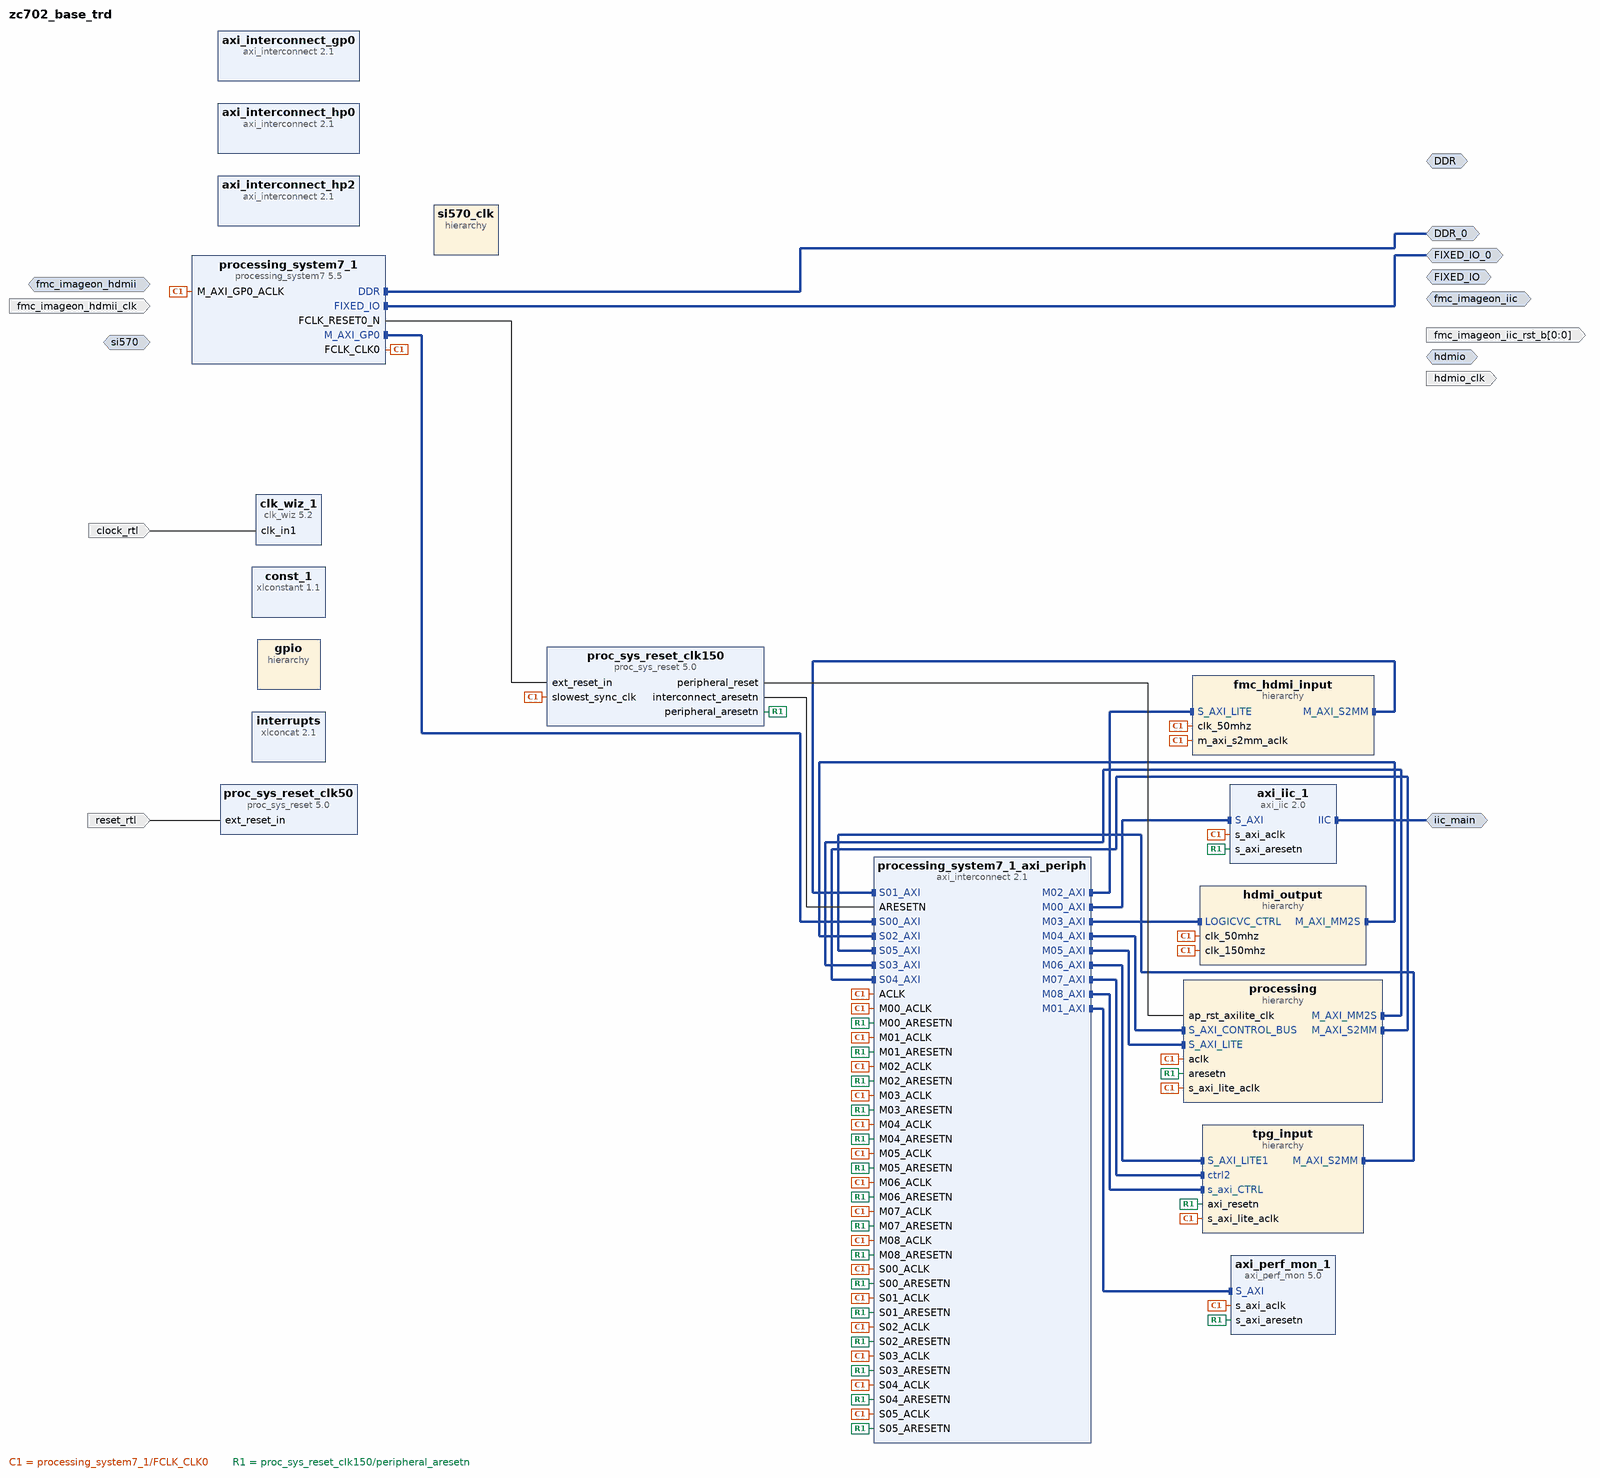
[diagram p0: block diagram of the top level]
# Vivado block design zc702_base_trd, Vivado 2015.4
create_bd_design zc702_base_trd

create_bd_intf_port -mode Master -vlnv xilinx.com:interface:ddrx_rtl:1.0 DDR
create_bd_intf_port -mode Master -vlnv xilinx.com:display_processing_system7:fixedio_rtl:1.0 FIXED_IO
create_bd_intf_port -mode Slave -vlnv avnet.com:interface:avnet_hdmi_rtl:1.0 fmc_imageon_hdmii
create_bd_intf_port -mode Master -vlnv xilinx.com:interface:iic_rtl:1.0 fmc_imageon_iic
create_bd_intf_port -mode Master -vlnv xilinx.com:interface:vid_io_rtl:1.0 hdmio
create_bd_intf_port -mode Slave -vlnv xilinx.com:interface:diff_clock_rtl:1.0 si570
create_bd_intf_port -mode Master -vlnv xilinx.com:interface:ddrx_rtl:1.0 DDR_0
create_bd_intf_port -mode Master -vlnv xilinx.com:display_processing_system7:fixedio_rtl:1.0 FIXED_IO_0
create_bd_intf_port -mode Master -vlnv xilinx.com:interface:iic_rtl:1.0 iic_main
create_bd_port -dir I -type clk fmc_imageon_hdmii_clk
set_property -dict {CONFIG.FREQ_HZ 148500000} [get_bd_ports fmc_imageon_hdmii_clk]
create_bd_port -dir O -from 0 -to 0 -type rst fmc_imageon_iic_rst_b
create_bd_port -dir O hdmio_clk
create_bd_port -dir I -type clk clock_rtl
set_property -dict {CONFIG.FREQ_HZ 100000000 CONFIG.PHASE 0.000} [get_bd_ports clock_rtl]
create_bd_port -dir I -type rst reset_rtl
set_property -dict {CONFIG.POLARITY ACTIVE_LOW} [get_bd_ports reset_rtl]

create_bd_cell -type ip -vlnv xilinx.com:ip:axi_iic:2.0 axi_iic_1
set_property -dict {CONFIG.USE_BOARD_FLOW true CONFIG.IIC_BOARD_INTERFACE iic_main} [get_bd_cells axi_iic_1]
create_bd_cell -type ip -vlnv xilinx.com:ip:axi_interconnect:2.1 axi_interconnect_gp0
set_property -dict {CONFIG.NUM_MI 9 CONFIG.M06_HAS_REGSLICE 1} [get_bd_cells axi_interconnect_gp0]
create_bd_cell -type ip -vlnv xilinx.com:ip:axi_interconnect:2.1 axi_interconnect_hp0
set_property -dict [list \
  CONFIG.NUM_SI 3 \
  CONFIG.NUM_MI 1 \
  CONFIG.STRATEGY 2 \
  CONFIG.ENABLE_ADVANCED_OPTIONS 1 \
  CONFIG.M00_HAS_REGSLICE 1 \
  CONFIG.M00_HAS_DATA_FIFO 2 \
  CONFIG.S00_HAS_REGSLICE 1 \
  CONFIG.S01_HAS_REGSLICE 1 \
  CONFIG.S02_HAS_DATA_FIFO 2 \
] [get_bd_cells axi_interconnect_hp0]
create_bd_cell -type ip -vlnv xilinx.com:ip:axi_interconnect:2.1 axi_interconnect_hp2
set_property -dict [list \
  CONFIG.NUM_SI 2 \
  CONFIG.NUM_MI 1 \
  CONFIG.STRATEGY 2 \
  CONFIG.ENABLE_ADVANCED_OPTIONS 1 \
  CONFIG.ENABLE_PROTOCOL_CHECKERS 0 \
  CONFIG.XBAR_DATA_WIDTH 64 \
  CONFIG.M00_HAS_REGSLICE 1 \
  CONFIG.M00_HAS_DATA_FIFO 2 \
  CONFIG.S00_HAS_REGSLICE 1 \
  CONFIG.S01_HAS_REGSLICE 1 \
] [get_bd_cells axi_interconnect_hp2]
create_bd_cell -type ip -vlnv xilinx.com:ip:axi_perf_mon:5.0 axi_perf_mon_1
set_property -dict [list \
  CONFIG.C_SLOT_3_AXI_PROTOCOL AXI3 \
  CONFIG.C_SLOT_2_AXI_PROTOCOL AXI3 \
  CONFIG.C_SLOT_1_AXI_PROTOCOL AXI3 \
  CONFIG.C_SLOT_0_AXI_PROTOCOL AXI3 \
  CONFIG.C_NUM_OF_COUNTERS 4 \
  CONFIG.C_NUM_MONITOR_SLOTS 2 \
  CONFIG.ENABLE_EXT_TRIGGERS 0 \
  CONFIG.C_ENABLE_PROFILE 1 \
] [get_bd_cells axi_perf_mon_1]
create_bd_cell -type ip -vlnv xilinx.com:ip:clk_wiz:5.2 clk_wiz_1
set_property -dict [list \
  CONFIG.USE_INCLK_SWITCHOVER false \
  CONFIG.CLKOUT2_USED true \
  CONFIG.NUM_OUT_CLKS 2 \
  CONFIG.CLKOUT1_REQUESTED_OUT_FREQ 50.000 \
  CONFIG.CLKOUT2_REQUESTED_OUT_FREQ 150.000 \
  CONFIG.PRIM_SOURCE No_buffer \
  CONFIG.USE_RESET false \
  CONFIG.CLKOUT1_JITTER 145.943 \
  CONFIG.CLKOUT1_PHASE_ERROR 94.994 \
  CONFIG.CLKOUT2_JITTER 116.798 \
  CONFIG.CLKOUT2_PHASE_ERROR 94.994 \
] [get_bd_cells clk_wiz_1]
create_bd_cell -type ip -vlnv xilinx.com:ip:xlconstant:1.1 const_1
create_bd_cell -type hier fmc_hdmi_input
create_bd_cell -type hier gpio
create_bd_cell -type hier hdmi_output
create_bd_cell -type ip -vlnv xilinx.com:ip:xlconcat:2.1 interrupts
set_property -dict {CONFIG.NUM_PORTS 8} [get_bd_cells interrupts]
create_bd_cell -type ip -vlnv xilinx.com:ip:proc_sys_reset:5.0 proc_sys_reset_clk50
set_property -dict {CONFIG.C_AUX_RESET_HIGH 0} [get_bd_cells proc_sys_reset_clk50]
create_bd_cell -type ip -vlnv xilinx.com:ip:proc_sys_reset:5.0 proc_sys_reset_clk150
set_property -dict {CONFIG.C_AUX_RESET_HIGH 0} [get_bd_cells proc_sys_reset_clk150]
create_bd_cell -type hier processing
create_bd_cell -type ip -vlnv xilinx.com:ip:processing_system7:5.5 processing_system7_1
set_property -dict [list \
  CONFIG.PCW_FCLK_CLK0_BUF true \
  CONFIG.PCW_UIPARAM_DDR_FREQ_MHZ 533.333333 \
  CONFIG.PCW_APU_PERIPHERAL_FREQMHZ 666.666666 \
  CONFIG.PCW_SDIO_PERIPHERAL_FREQMHZ 50 \
  CONFIG.PCW_UART_PERIPHERAL_FREQMHZ 50 \
  CONFIG.PCW_CAN_PERIPHERAL_FREQMHZ 23.8095 \
  CONFIG.PCW_I2C_PERIPHERAL_FREQMHZ 111.111115 \
  CONFIG.PCW_FPGA0_PERIPHERAL_FREQMHZ 50 \
  CONFIG.PCW_FPGA1_PERIPHERAL_FREQMHZ 50 \
  CONFIG.PCW_M_AXI_GP0_FREQMHZ 10 \
  CONFIG.PCW_PERIPHERAL_BOARD_PRESET part0 \
  CONFIG.PCW_PRESET_BANK0_VOLTAGE {LVCMOS 1.8V} \
  CONFIG.PCW_PRESET_BANK1_VOLTAGE {LVCMOS 1.8V} \
  CONFIG.PCW_UIPARAM_DDR_PARTNO {MT41J256M8 HX-15E} \
  CONFIG.PCW_QSPI_PERIPHERAL_ENABLE 1 \
  CONFIG.PCW_QSPI_QSPI_IO {MIO 1 .. 6} \
  CONFIG.PCW_QSPI_GRP_SINGLE_SS_ENABLE 1 \
  CONFIG.PCW_QSPI_GRP_SINGLE_SS_IO {MIO 1 .. 6} \
  CONFIG.PCW_QSPI_GRP_FBCLK_ENABLE 1 \
  CONFIG.PCW_QSPI_GRP_FBCLK_IO {MIO 8} \
  CONFIG.PCW_ENET0_PERIPHERAL_ENABLE 1 \
  CONFIG.PCW_ENET0_ENET0_IO {MIO 16 .. 27} \
  CONFIG.PCW_ENET0_GRP_MDIO_ENABLE 1 \
  CONFIG.PCW_ENET0_GRP_MDIO_IO {MIO 52 .. 53} \
  CONFIG.PCW_ENET_RESET_ENABLE 1 \
  CONFIG.PCW_ENET_RESET_SELECT {Share reset pin} \
  CONFIG.PCW_ENET0_RESET_ENABLE 1 \
  CONFIG.PCW_ENET0_RESET_IO {MIO 11} \
  CONFIG.PCW_SD0_PERIPHERAL_ENABLE 1 \
  CONFIG.PCW_SD0_SD0_IO {MIO 40 .. 45} \
  CONFIG.PCW_SD0_GRP_CD_ENABLE 1 \
  CONFIG.PCW_SD0_GRP_CD_IO {MIO 0} \
  CONFIG.PCW_SD0_GRP_WP_ENABLE 1 \
  CONFIG.PCW_SD0_GRP_WP_IO {MIO 15} \
  CONFIG.PCW_UART1_PERIPHERAL_ENABLE 1 \
  CONFIG.PCW_UART1_UART1_IO {MIO 48 .. 49} \
  CONFIG.PCW_CAN0_PERIPHERAL_ENABLE 1 \
  CONFIG.PCW_CAN0_CAN0_IO {MIO 46 .. 47} \
  CONFIG.PCW_TTC0_PERIPHERAL_ENABLE 1 \
  CONFIG.PCW_TTC0_TTC0_IO EMIO \
  CONFIG.PCW_USB0_PERIPHERAL_ENABLE 1 \
  CONFIG.PCW_USB0_USB0_IO {MIO 28 .. 39} \
  CONFIG.PCW_USB_RESET_ENABLE 1 \
  CONFIG.PCW_USB_RESET_SELECT {Share reset pin} \
  CONFIG.PCW_USB0_RESET_ENABLE 1 \
  CONFIG.PCW_USB0_RESET_IO {MIO 7} \
  CONFIG.PCW_I2C0_PERIPHERAL_ENABLE 1 \
  CONFIG.PCW_I2C0_I2C0_IO {MIO 50 .. 51} \
  CONFIG.PCW_I2C0_GRP_INT_ENABLE 0 \
  CONFIG.PCW_I2C0_RESET_ENABLE 1 \
  CONFIG.PCW_I2C0_RESET_IO {MIO 13} \
  CONFIG.PCW_I2C_RESET_ENABLE 1 \
  CONFIG.PCW_I2C_RESET_SELECT {Share reset pin} \
  CONFIG.PCW_GPIO_MIO_GPIO_ENABLE 1 \
  CONFIG.PCW_GPIO_MIO_GPIO_IO MIO \
  CONFIG.PCW_ENET0_PERIPHERAL_FREQMHZ {100 Mbps} \
  CONFIG.preset ZC702 \
] [get_bd_cells processing_system7_1]
# 497 more settings of processing_system7_1 are not shown: defaults, MIO pin electricals, DDR timing, and values the tool derives
create_bd_cell -type hier si570_clk
create_bd_cell -type hier tpg_input
create_bd_cell -type ip -vlnv xilinx.com:ip:axi_interconnect:2.1 processing_system7_1_axi_periph
set_property -dict {CONFIG.NUM_SI 6 CONFIG.NUM_MI 9} [get_bd_cells processing_system7_1_axi_periph]

# ---- hierarchy /fmc_hdmi_input ----
current_bd_instance /fmc_hdmi_input
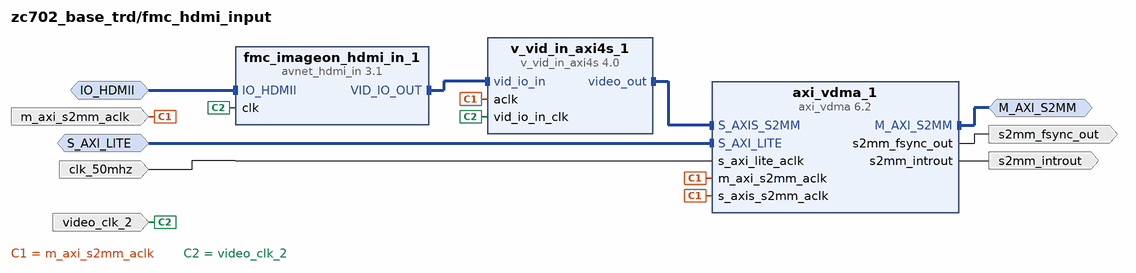
[diagram p1: block diagram inside /fmc_hdmi_input]
create_bd_intf_pin -mode Slave -vlnv avnet.com:interface:avnet_hdmi_rtl:1.0 IO_HDMII
create_bd_intf_pin -mode Master -vlnv xilinx.com:interface:aximm_rtl:1.0 M_AXI_S2MM
create_bd_intf_pin -mode Slave -vlnv xilinx.com:interface:aximm_rtl:1.0 S_AXI_LITE
create_bd_pin -dir I -type clk clk_50mhz
create_bd_pin -dir I -type clk m_axi_s2mm_aclk
create_bd_pin -dir O s2mm_fsync_out
create_bd_pin -dir O -type intr s2mm_introut
create_bd_pin -dir I video_clk_2

create_bd_cell -type ip -vlnv xilinx.com:ip:axi_vdma:6.2 axi_vdma_1
set_property -dict [list \
  CONFIG.c_m_axi_s2mm_data_width 32 \
  CONFIG.c_include_s2mm_dre 0 \
  CONFIG.c_include_s2mm_sf 0 \
  CONFIG.c_num_fstores 1 \
  CONFIG.c_s2mm_sof_enable 1 \
  CONFIG.c_s2mm_genlock_mode 2 \
  CONFIG.c_s2mm_linebuffer_depth 4096 \
  CONFIG.c_include_mm2s 0 \
  CONFIG.c_s2mm_max_burst_length 16 \
  CONFIG.c_enable_debug_info_11 1 \
  CONFIG.c_enable_debug_info_15 1 \
] [get_bd_cells axi_vdma_1]
create_bd_cell -type ip -vlnv avnet:avnet_hdmi:avnet_hdmi_in:3.1 fmc_imageon_hdmi_in_1
create_bd_cell -type ip -vlnv xilinx.com:ip:v_vid_in_axi4s:4.0 v_vid_in_axi4s_1
set_property -dict {CONFIG.C_M_AXIS_VIDEO_FORMAT 0 CONFIG.C_HAS_ASYNC_CLK 1} [get_bd_cells v_vid_in_axi4s_1]

# ---- hierarchy /gpio ----
current_bd_instance /gpio
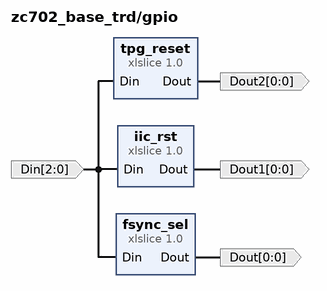
[diagram p2: block diagram inside /gpio]
create_bd_pin -dir I -from 2 -to 0 Din
create_bd_pin -dir O -from 0 -to 0 Dout
create_bd_pin -dir O -from 0 -to 0 Dout1
create_bd_pin -dir O -from 0 -to 0 Dout2

create_bd_cell -type ip -vlnv xilinx.com:ip:xlslice:1.0 fsync_sel
set_property -dict {CONFIG.DOUT_WIDTH 1 CONFIG.DIN_TO 1 CONFIG.DIN_FROM 1 CONFIG.DIN_WIDTH 3} [get_bd_cells fsync_sel]
create_bd_cell -type ip -vlnv xilinx.com:ip:xlslice:1.0 iic_rst
set_property -dict {CONFIG.DIN_TO 0 CONFIG.DIN_FROM 0 CONFIG.DIN_WIDTH 3} [get_bd_cells iic_rst]
create_bd_cell -type ip -vlnv xilinx.com:ip:xlslice:1.0 tpg_reset
set_property -dict {CONFIG.DOUT_WIDTH 1 CONFIG.DIN_TO 2 CONFIG.DIN_FROM 2 CONFIG.DIN_WIDTH 3} [get_bd_cells tpg_reset]

# ---- hierarchy /hdmi_output ----
current_bd_instance /hdmi_output
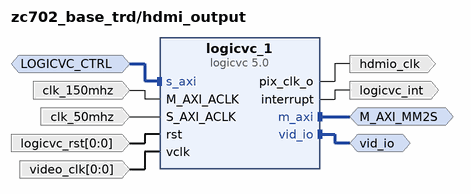
[diagram p3: block diagram inside /hdmi_output]
create_bd_intf_pin -mode Slave -vlnv xilinx.com:interface:aximm_rtl:1.0 LOGICVC_CTRL
create_bd_intf_pin -mode Master -vlnv xilinx.com:interface:aximm_rtl:1.0 M_AXI_MM2S
create_bd_intf_pin -mode Master -vlnv xilinx.com:interface:vid_io_rtl:1.0 vid_io
create_bd_pin -dir I -type clk clk_150mhz
create_bd_pin -dir I -type clk clk_50mhz
create_bd_pin -dir O hdmio_clk
create_bd_pin -dir O -type intr logicvc_int
create_bd_pin -dir I -from 0 -to 0 logicvc_rst
create_bd_pin -dir I -from 0 -to 0 video_clk

create_bd_cell -type ip -vlnv logicbricks.com:logicbricks:logicvc:5.0 logicvc_1
set_property -dict [list \
  CONFIG.C_ENABLE_THREE_STATE_CONTROL 0 \
  CONFIG.C_LAYER_1_ADDR 0x31950000 \
  CONFIG.C_LAYER_0_ADDR 0x30000000 \
  CONFIG.C_USE_XTREME_DSP 1 \
  CONFIG.C_USE_BACKGROUND 1 \
  CONFIG.C_LAYER_2_DATA_WIDTH 24 \
  CONFIG.C_LAYER_0_DATA_WIDTH 24 \
  CONFIG.C_LAYER_1_TYPE 1 \
  CONFIG.C_NUM_OF_LAYERS 3 \
  CONFIG.C_DISPLAY_COLOR_SPACE 1 \
  CONFIG.C_ROW_STRIDE 2048 \
  CONFIG.C_M_AXI_DATA_WIDTH 64 \
  CONFIG.C_INCREASE_FIFO 4 \
] [get_bd_cells logicvc_1]

# ---- hierarchy /processing ----
current_bd_instance /processing
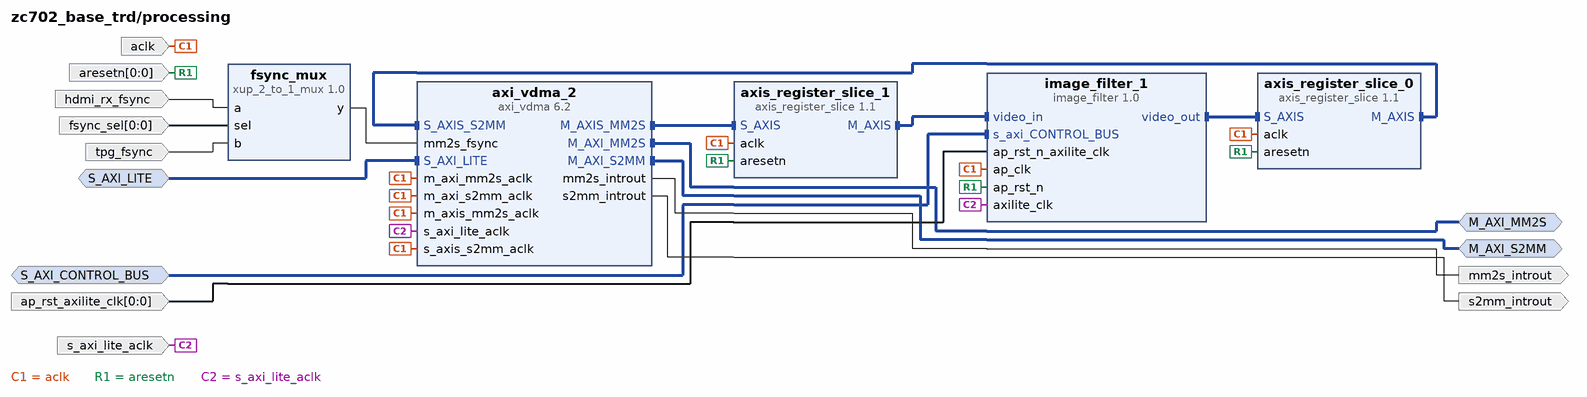
[diagram p4: block diagram inside /processing]
create_bd_intf_pin -mode Master -vlnv xilinx.com:interface:aximm_rtl:1.0 M_AXI_MM2S
create_bd_intf_pin -mode Master -vlnv xilinx.com:interface:aximm_rtl:1.0 M_AXI_S2MM
create_bd_intf_pin -mode Slave -vlnv xilinx.com:interface:aximm_rtl:1.0 S_AXI_CONTROL_BUS
create_bd_intf_pin -mode Slave -vlnv xilinx.com:interface:aximm_rtl:1.0 S_AXI_LITE
create_bd_pin -dir I -type clk aclk
create_bd_pin -dir I -from 0 -to 0 -type rst ap_rst_axilite_clk
create_bd_pin -dir I -from 0 -to 0 -type rst aresetn
create_bd_pin -dir I -from 0 -to 0 fsync_sel
create_bd_pin -dir I hdmi_rx_fsync
create_bd_pin -dir O -type intr mm2s_introut
create_bd_pin -dir O -type intr s2mm_introut
create_bd_pin -dir I -type clk s_axi_lite_aclk
create_bd_pin -dir I tpg_fsync

create_bd_cell -type ip -vlnv xilinx.com:ip:axi_vdma:6.2 axi_vdma_2
set_property -dict [list \
  CONFIG.c_m_axi_mm2s_data_width 32 \
  CONFIG.c_m_axis_mm2s_tdata_width 16 \
  CONFIG.c_m_axi_s2mm_data_width 32 \
  CONFIG.c_num_fstores 1 \
  CONFIG.c_use_mm2s_fsync 1 \
  CONFIG.c_use_s2mm_fsync 2 \
  CONFIG.c_mm2s_genlock_mode 3 \
  CONFIG.c_s2mm_genlock_mode 2 \
  CONFIG.c_mm2s_linebuffer_depth 4096 \
  CONFIG.c_s2mm_linebuffer_depth 4096 \
  CONFIG.c_mm2s_max_burst_length 16 \
  CONFIG.c_s2mm_max_burst_length 16 \
  CONFIG.c_enable_debug_info_7 1 \
  CONFIG.c_enable_debug_info_15 1 \
] [get_bd_cells axi_vdma_2]
create_bd_cell -type ip -vlnv xilinx.com:ip:axis_register_slice:1.1 axis_register_slice_0
create_bd_cell -type ip -vlnv xilinx.com:ip:axis_register_slice:1.1 axis_register_slice_1
create_bd_cell -type ip -vlnv xilinx.com:xup:xup_2_to_1_mux:1.0 fsync_mux
set_property -dict {CONFIG.DELAY 0} [get_bd_cells fsync_mux]
create_bd_cell -type ip -vlnv xilinx.com:hls:image_filter:1.0 image_filter_1

# ---- hierarchy /si570_clk ----
current_bd_instance /si570_clk
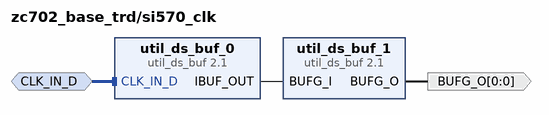
[diagram p5: block diagram inside /si570_clk]
create_bd_intf_pin -mode Slave -vlnv xilinx.com:interface:diff_clock_rtl:1.0 CLK_IN_D
create_bd_pin -dir O -from 0 -to 0 BUFG_O

create_bd_cell -type ip -vlnv xilinx.com:ip:util_ds_buf:2.1 util_ds_buf_0
create_bd_cell -type ip -vlnv xilinx.com:ip:util_ds_buf:2.1 util_ds_buf_1
set_property -dict {CONFIG.C_BUF_TYPE BUFG} [get_bd_cells util_ds_buf_1]

# ---- hierarchy /tpg_input ----
current_bd_instance /tpg_input
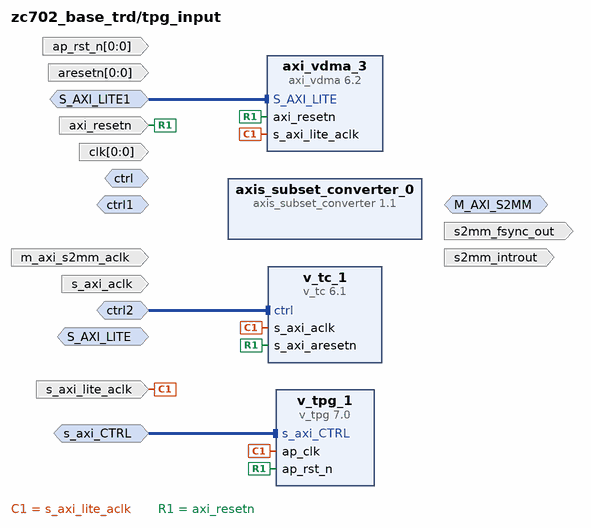
[diagram p6: block diagram inside /tpg_input]
create_bd_intf_pin -mode Master -vlnv xilinx.com:interface:aximm_rtl:1.0 M_AXI_S2MM
create_bd_intf_pin -mode Slave -vlnv xilinx.com:interface:aximm_rtl:1.0 S_AXI_LITE
create_bd_intf_pin -mode Slave -vlnv xilinx.com:interface:aximm_rtl:1.0 ctrl
create_bd_intf_pin -mode Slave -vlnv xilinx.com:interface:aximm_rtl:1.0 ctrl1
create_bd_intf_pin -mode Slave -vlnv xilinx.com:interface:aximm_rtl:1.0 S_AXI_LITE1
create_bd_intf_pin -mode Slave -vlnv xilinx.com:interface:aximm_rtl:1.0 ctrl2
create_bd_intf_pin -mode Slave -vlnv xilinx.com:interface:aximm_rtl:1.0 s_axi_CTRL
create_bd_pin -dir I -from 0 -to 0 ap_rst_n
create_bd_pin -dir I -from 0 -to 0 -type rst aresetn
create_bd_pin -dir I -from 0 -to 0 -type clk clk
create_bd_pin -dir I -type clk m_axi_s2mm_aclk
create_bd_pin -dir O s2mm_fsync_out
create_bd_pin -dir O -type intr s2mm_introut
create_bd_pin -dir I -type clk s_axi_aclk
create_bd_pin -dir I -type clk s_axi_lite_aclk
create_bd_pin -dir I -type rst axi_resetn

create_bd_cell -type ip -vlnv xilinx.com:ip:axi_vdma:6.2 axi_vdma_3
set_property -dict [list \
  CONFIG.c_m_axi_s2mm_data_width 32 \
  CONFIG.c_include_s2mm_dre 0 \
  CONFIG.c_include_s2mm_sf 0 \
  CONFIG.c_num_fstores 1 \
  CONFIG.c_s2mm_sof_enable 1 \
  CONFIG.c_s2mm_genlock_mode 2 \
  CONFIG.c_s2mm_linebuffer_depth 4096 \
  CONFIG.c_include_mm2s 0 \
  CONFIG.c_s2mm_max_burst_length 16 \
  CONFIG.c_enable_debug_info_11 1 \
  CONFIG.c_enable_debug_info_15 1 \
] [get_bd_cells axi_vdma_3]
create_bd_cell -type ip -vlnv xilinx.com:ip:axis_subset_converter:1.1 axis_subset_converter_0
set_property -dict [list \
  CONFIG.S_TDATA_NUM_BYTES 3 \
  CONFIG.M_TDATA_NUM_BYTES 2 \
  CONFIG.TDATA_REMAP {tdata[15:0]} \
] [get_bd_cells axis_subset_converter_0]
create_bd_cell -type ip -vlnv xilinx.com:ip:v_tc:6.1 v_tc_1
set_property -dict [list \
  CONFIG.VIDEO_MODE 1080p \
  CONFIG.enable_detection false \
  CONFIG.vertical_blank_generation true \
] [get_bd_cells v_tc_1]
create_bd_cell -type ip -vlnv xilinx.com:ip:v_tpg:7.0 v_tpg_1

# ---- connections ----

current_bd_instance /fmc_hdmi_input
connect_bd_intf_net -intf_net fmc_imageon_hdmi_in_0_VID_IO_OUT [get_bd_intf_pins fmc_imageon_hdmi_in_1/VID_IO_OUT] [get_bd_intf_pins v_vid_in_axi4s_1/vid_io_in]
connect_bd_intf_net [get_bd_intf_pins axi_vdma_1/S_AXIS_S2MM] [get_bd_intf_pins v_vid_in_axi4s_1/video_out]
connect_bd_intf_net [get_bd_intf_pins IO_HDMII] [get_bd_intf_pins fmc_imageon_hdmi_in_1/IO_HDMII]
connect_bd_intf_net [get_bd_intf_pins M_AXI_S2MM] [get_bd_intf_pins axi_vdma_1/M_AXI_S2MM]
connect_bd_intf_net [get_bd_intf_pins S_AXI_LITE] [get_bd_intf_pins axi_vdma_1/S_AXI_LITE]
connect_bd_net [get_bd_pins axi_vdma_1/s2mm_fsync_out] [get_bd_pins s2mm_fsync_out]
connect_bd_net [get_bd_pins axi_vdma_1/s2mm_introut] [get_bd_pins s2mm_introut]
connect_bd_net -net clk_75mhz [get_bd_pins clk_50mhz] [get_bd_pins axi_vdma_1/s_axi_lite_aclk]
connect_bd_net [get_bd_pins m_axi_s2mm_aclk] \
  [get_bd_pins axi_vdma_1/m_axi_s2mm_aclk] [get_bd_pins axi_vdma_1/s_axis_s2mm_aclk] [get_bd_pins v_vid_in_axi4s_1/aclk]
connect_bd_net -net vtiming_mux_0_video_clk [get_bd_pins video_clk_2] \
  [get_bd_pins fmc_imageon_hdmi_in_1/clk] [get_bd_pins v_vid_in_axi4s_1/vid_io_in_clk]

current_bd_instance /gpio
connect_bd_net [get_bd_pins Din] [get_bd_pins fsync_sel/Din] [get_bd_pins iic_rst/Din] [get_bd_pins tpg_reset/Din]
connect_bd_net -net fsync_sel_1 [get_bd_pins fsync_sel/Dout] [get_bd_pins Dout]
connect_bd_net [get_bd_pins iic_rst/Dout] [get_bd_pins Dout1]
connect_bd_net [get_bd_pins tpg_reset/Dout] [get_bd_pins Dout2]

current_bd_instance /hdmi_output
connect_bd_intf_net [get_bd_intf_pins LOGICVC_CTRL] [get_bd_intf_pins logicvc_1/s_axi]
connect_bd_intf_net [get_bd_intf_pins M_AXI_MM2S] [get_bd_intf_pins logicvc_1/m_axi]
connect_bd_intf_net [get_bd_intf_pins vid_io] [get_bd_intf_pins logicvc_1/vid_io]
connect_bd_net [get_bd_pins clk_150mhz] [get_bd_pins logicvc_1/M_AXI_ACLK]
connect_bd_net -net clk_75mhz_1 [get_bd_pins clk_50mhz] [get_bd_pins logicvc_1/S_AXI_ACLK]
connect_bd_net [get_bd_pins logicvc_1/interrupt] [get_bd_pins logicvc_int]
connect_bd_net [get_bd_pins logicvc_1/pix_clk_o] [get_bd_pins hdmio_clk]
connect_bd_net [get_bd_pins logicvc_rst] [get_bd_pins logicvc_1/rst]
connect_bd_net [get_bd_pins video_clk] [get_bd_pins logicvc_1/vclk]

current_bd_instance /processing
connect_bd_intf_net [get_bd_intf_pins axi_vdma_2/M_AXIS_MM2S] [get_bd_intf_pins axis_register_slice_1/S_AXIS]
connect_bd_intf_net [get_bd_intf_pins axi_vdma_2/S_AXIS_S2MM] [get_bd_intf_pins axis_register_slice_0/M_AXIS]
connect_bd_intf_net [get_bd_intf_pins axis_register_slice_1/M_AXIS] [get_bd_intf_pins image_filter_1/video_in]
connect_bd_intf_net -intf_net image_filter_1_OUTPUT_STREAM [get_bd_intf_pins axis_register_slice_0/S_AXIS] [get_bd_intf_pins image_filter_1/video_out]
connect_bd_intf_net [get_bd_intf_pins M_AXI_MM2S] [get_bd_intf_pins axi_vdma_2/M_AXI_MM2S]
connect_bd_intf_net [get_bd_intf_pins M_AXI_S2MM] [get_bd_intf_pins axi_vdma_2/M_AXI_S2MM]
connect_bd_intf_net -intf_net axi_interconnect_gp0_M06_AXI [get_bd_intf_pins S_AXI_CONTROL_BUS] [get_bd_intf_pins image_filter_1/s_axi_CONTROL_BUS]
connect_bd_intf_net [get_bd_intf_pins S_AXI_LITE] [get_bd_intf_pins axi_vdma_2/S_AXI_LITE]
connect_bd_net -net a_1 [get_bd_pins hdmi_rx_fsync] [get_bd_pins fsync_mux/a]
connect_bd_net [get_bd_pins ap_rst_axilite_clk] [get_bd_pins image_filter_1/ap_rst_n_axilite_clk]
connect_bd_net [get_bd_pins axi_vdma_2/mm2s_introut] [get_bd_pins mm2s_introut]
connect_bd_net [get_bd_pins axi_vdma_2/s2mm_introut] [get_bd_pins s2mm_introut]
connect_bd_net -net clk_150mhz [get_bd_pins aclk] \
  [get_bd_pins axi_vdma_2/m_axi_mm2s_aclk] [get_bd_pins axi_vdma_2/m_axi_s2mm_aclk] [get_bd_pins axi_vdma_2/m_axis_mm2s_aclk] \
  [get_bd_pins axi_vdma_2/s_axis_s2mm_aclk] [get_bd_pins axis_register_slice_0/aclk] [get_bd_pins axis_register_slice_1/aclk] \
  [get_bd_pins image_filter_1/ap_clk]
connect_bd_net [get_bd_pins fsync_mux/y] [get_bd_pins axi_vdma_2/mm2s_fsync]
connect_bd_net [get_bd_pins fsync_sel] [get_bd_pins fsync_mux/sel]
connect_bd_net -net mm2s_fsync_1 [get_bd_pins tpg_fsync] [get_bd_pins fsync_mux/b]
connect_bd_net -net proc_sys_reset_1_interconnect_aresetn [get_bd_pins aresetn] \
  [get_bd_pins axis_register_slice_0/aresetn] [get_bd_pins axis_register_slice_1/aresetn] \
  [get_bd_pins image_filter_1/ap_rst_n]
connect_bd_net [get_bd_pins s_axi_lite_aclk] [get_bd_pins axi_vdma_2/s_axi_lite_aclk] [get_bd_pins image_filter_1/axilite_clk]

current_bd_instance /si570_clk
connect_bd_intf_net [get_bd_intf_pins CLK_IN_D] [get_bd_intf_pins util_ds_buf_0/CLK_IN_D]
connect_bd_net [get_bd_pins util_ds_buf_0/IBUF_OUT] [get_bd_pins util_ds_buf_1/BUFG_I]
connect_bd_net -net video_clk_1 [get_bd_pins util_ds_buf_1/BUFG_O] [get_bd_pins BUFG_O]

current_bd_instance /tpg_input
connect_bd_intf_net [get_bd_intf_pins S_AXI_LITE1] [get_bd_intf_pins axi_vdma_3/S_AXI_LITE]
connect_bd_intf_net [get_bd_intf_pins ctrl2] [get_bd_intf_pins v_tc_1/ctrl]
connect_bd_intf_net [get_bd_intf_pins s_axi_CTRL] [get_bd_intf_pins v_tpg_1/s_axi_CTRL]
connect_bd_net [get_bd_pins s_axi_lite_aclk] [get_bd_pins axi_vdma_3/s_axi_lite_aclk] [get_bd_pins v_tc_1/s_axi_aclk] [get_bd_pins v_tpg_1/ap_clk]
connect_bd_net [get_bd_pins axi_resetn] [get_bd_pins axi_vdma_3/axi_resetn] [get_bd_pins v_tc_1/s_axi_aresetn] [get_bd_pins v_tpg_1/ap_rst_n]

current_bd_instance /
connect_bd_intf_net [get_bd_intf_pins processing_system7_1/M_AXI_GP0] [get_bd_intf_pins processing_system7_1_axi_periph/S00_AXI]
connect_bd_intf_net [get_bd_intf_pins processing_system7_1_axi_periph/M00_AXI] [get_bd_intf_pins axi_iic_1/S_AXI]
connect_bd_intf_net [get_bd_intf_pins processing_system7_1_axi_periph/M01_AXI] [get_bd_intf_pins axi_perf_mon_1/S_AXI]
connect_bd_intf_net [get_bd_intf_pins processing_system7_1_axi_periph/M02_AXI] [get_bd_intf_pins fmc_hdmi_input/S_AXI_LITE]
connect_bd_intf_net [get_bd_intf_pins processing_system7_1_axi_periph/M03_AXI] [get_bd_intf_pins hdmi_output/LOGICVC_CTRL]
connect_bd_intf_net [get_bd_intf_pins processing_system7_1_axi_periph/M04_AXI] [get_bd_intf_pins processing/S_AXI_CONTROL_BUS]
connect_bd_intf_net [get_bd_intf_pins processing_system7_1_axi_periph/M05_AXI] [get_bd_intf_pins processing/S_AXI_LITE]
connect_bd_intf_net [get_bd_intf_pins processing_system7_1_axi_periph/M06_AXI] [get_bd_intf_pins tpg_input/S_AXI_LITE1]
connect_bd_intf_net [get_bd_intf_pins processing_system7_1_axi_periph/M07_AXI] [get_bd_intf_pins tpg_input/ctrl2]
connect_bd_intf_net [get_bd_intf_pins processing_system7_1_axi_periph/M08_AXI] [get_bd_intf_pins tpg_input/s_axi_CTRL]
connect_bd_intf_net [get_bd_intf_pins fmc_hdmi_input/M_AXI_S2MM] [get_bd_intf_pins processing_system7_1_axi_periph/S01_AXI]
connect_bd_intf_net [get_bd_intf_pins hdmi_output/M_AXI_MM2S] [get_bd_intf_pins processing_system7_1_axi_periph/S02_AXI]
connect_bd_intf_net [get_bd_intf_pins processing/M_AXI_MM2S] [get_bd_intf_pins processing_system7_1_axi_periph/S03_AXI]
connect_bd_intf_net [get_bd_intf_pins processing/M_AXI_S2MM] [get_bd_intf_pins processing_system7_1_axi_periph/S04_AXI]
connect_bd_intf_net [get_bd_intf_pins tpg_input/M_AXI_S2MM] [get_bd_intf_pins processing_system7_1_axi_periph/S05_AXI]
connect_bd_intf_net [get_bd_intf_ports DDR_0] [get_bd_intf_pins processing_system7_1/DDR]
connect_bd_intf_net [get_bd_intf_ports FIXED_IO_0] [get_bd_intf_pins processing_system7_1/FIXED_IO]
connect_bd_intf_net [get_bd_intf_ports iic_main] [get_bd_intf_pins axi_iic_1/IIC]
connect_bd_net [get_bd_pins processing_system7_1/FCLK_CLK0] \
  [get_bd_pins processing_system7_1/M_AXI_GP0_ACLK] [get_bd_pins processing_system7_1_axi_periph/S00_ACLK] \
  [get_bd_pins proc_sys_reset_clk150/slowest_sync_clk] [get_bd_pins processing_system7_1_axi_periph/ACLK] \
  [get_bd_pins axi_iic_1/s_axi_aclk] [get_bd_pins processing_system7_1_axi_periph/M00_ACLK] \
  [get_bd_pins axi_perf_mon_1/s_axi_aclk] [get_bd_pins processing_system7_1_axi_periph/M01_ACLK] \
  [get_bd_pins fmc_hdmi_input/clk_50mhz] [get_bd_pins processing_system7_1_axi_periph/M02_ACLK] \
  [get_bd_pins hdmi_output/clk_50mhz] [get_bd_pins processing_system7_1_axi_periph/M03_ACLK] \
  [get_bd_pins processing/s_axi_lite_aclk] [get_bd_pins processing_system7_1_axi_periph/M04_ACLK] \
  [get_bd_pins processing_system7_1_axi_periph/M05_ACLK] [get_bd_pins tpg_input/s_axi_lite_aclk] \
  [get_bd_pins processing_system7_1_axi_periph/M06_ACLK] [get_bd_pins processing_system7_1_axi_periph/M07_ACLK] \
  [get_bd_pins processing_system7_1_axi_periph/M08_ACLK] [get_bd_pins fmc_hdmi_input/m_axi_s2mm_aclk] \
  [get_bd_pins processing_system7_1_axi_periph/S01_ACLK] [get_bd_pins hdmi_output/clk_150mhz] \
  [get_bd_pins processing_system7_1_axi_periph/S02_ACLK] [get_bd_pins processing/aclk] \
  [get_bd_pins processing_system7_1_axi_periph/S03_ACLK] [get_bd_pins processing_system7_1_axi_periph/S04_ACLK] \
  [get_bd_pins processing_system7_1_axi_periph/S05_ACLK]
connect_bd_net [get_bd_pins proc_sys_reset_clk150/peripheral_aresetn] \
  [get_bd_pins processing_system7_1_axi_periph/S00_ARESETN] [get_bd_pins axi_iic_1/s_axi_aresetn] \
  [get_bd_pins processing_system7_1_axi_periph/M00_ARESETN] [get_bd_pins axi_perf_mon_1/s_axi_aresetn] \
  [get_bd_pins processing_system7_1_axi_periph/M01_ARESETN] [get_bd_pins processing_system7_1_axi_periph/M02_ARESETN] \
  [get_bd_pins processing_system7_1_axi_periph/M03_ARESETN] [get_bd_pins processing_system7_1_axi_periph/M04_ARESETN] \
  [get_bd_pins processing_system7_1_axi_periph/M05_ARESETN] [get_bd_pins tpg_input/axi_resetn] \
  [get_bd_pins processing_system7_1_axi_periph/M06_ARESETN] [get_bd_pins processing_system7_1_axi_periph/M07_ARESETN] \
  [get_bd_pins processing_system7_1_axi_periph/M08_ARESETN] [get_bd_pins processing_system7_1_axi_periph/S01_ARESETN] \
  [get_bd_pins processing_system7_1_axi_periph/S02_ARESETN] [get_bd_pins processing/aresetn] \
  [get_bd_pins processing_system7_1_axi_periph/S03_ARESETN] [get_bd_pins processing_system7_1_axi_periph/S04_ARESETN] \
  [get_bd_pins processing_system7_1_axi_periph/S05_ARESETN]
connect_bd_net [get_bd_pins processing_system7_1/FCLK_RESET0_N] [get_bd_pins proc_sys_reset_clk150/ext_reset_in]
connect_bd_net [get_bd_pins proc_sys_reset_clk150/interconnect_aresetn] [get_bd_pins processing_system7_1_axi_periph/ARESETN]
connect_bd_net [get_bd_ports clock_rtl] [get_bd_pins clk_wiz_1/clk_in1]
connect_bd_net [get_bd_ports reset_rtl] [get_bd_pins proc_sys_reset_clk50/ext_reset_in]
connect_bd_net [get_bd_pins proc_sys_reset_clk150/peripheral_reset] [get_bd_pins processing/ap_rst_axilite_clk]

# ---- address map ----
exclude_bd_addr_seg -offset 0x41600000 -range 64K -target_address_space [get_bd_addr_spaces fmc_hdmi_input/axi_vdma_1/Data_S2MM] [get_bd_addr_segs axi_iic_1/S_AXI/Reg]
exclude_bd_addr_seg -offset 0x43000000 -range 64K -target_address_space [get_bd_addr_spaces fmc_hdmi_input/axi_vdma_1/Data_S2MM] [get_bd_addr_segs fmc_hdmi_input/axi_vdma_1/S_AXI_LITE/Reg]
exclude_bd_addr_seg -offset 0x43010000 -range 64K -target_address_space [get_bd_addr_spaces fmc_hdmi_input/axi_vdma_1/Data_S2MM] [get_bd_addr_segs processing/axi_vdma_2/S_AXI_LITE/Reg]
exclude_bd_addr_seg -offset 0x43020000 -range 64K -target_address_space [get_bd_addr_spaces fmc_hdmi_input/axi_vdma_1/Data_S2MM] [get_bd_addr_segs tpg_input/axi_vdma_3/S_AXI_LITE/Reg]
exclude_bd_addr_seg -offset 0x43C00000 -range 64K -target_address_space [get_bd_addr_spaces fmc_hdmi_input/axi_vdma_1/Data_S2MM] [get_bd_addr_segs axi_perf_mon_1/S_AXI/Reg]
exclude_bd_addr_seg -offset 0x43C10000 -range 64K -target_address_space [get_bd_addr_spaces fmc_hdmi_input/axi_vdma_1/Data_S2MM] [get_bd_addr_segs hdmi_output/logicvc_1/s_axi/reg0]
exclude_bd_addr_seg -offset 0x43C20000 -range 64K -target_address_space [get_bd_addr_spaces fmc_hdmi_input/axi_vdma_1/Data_S2MM] [get_bd_addr_segs processing/image_filter_1/s_axi_CONTROL_BUS/Reg]
exclude_bd_addr_seg -offset 0x43C30000 -range 64K -target_address_space [get_bd_addr_spaces fmc_hdmi_input/axi_vdma_1/Data_S2MM] [get_bd_addr_segs tpg_input/v_tc_1/ctrl/Reg]
exclude_bd_addr_seg -offset 0x43C40000 -range 64K -target_address_space [get_bd_addr_spaces fmc_hdmi_input/axi_vdma_1/Data_S2MM] [get_bd_addr_segs tpg_input/v_tpg_1/s_axi_CTRL/Reg]
assign_bd_address -offset 0x41600000 -range 64K -target_address_space [get_bd_addr_spaces hdmi_output/logicvc_1/videoData] [get_bd_addr_segs axi_iic_1/S_AXI/Reg]
assign_bd_address -offset 0x43000000 -range 64K -target_address_space [get_bd_addr_spaces hdmi_output/logicvc_1/videoData] [get_bd_addr_segs fmc_hdmi_input/axi_vdma_1/S_AXI_LITE/Reg]
assign_bd_address -offset 0x43010000 -range 64K -target_address_space [get_bd_addr_spaces hdmi_output/logicvc_1/videoData] [get_bd_addr_segs processing/axi_vdma_2/S_AXI_LITE/Reg]
assign_bd_address -offset 0x43020000 -range 64K -target_address_space [get_bd_addr_spaces hdmi_output/logicvc_1/videoData] [get_bd_addr_segs tpg_input/axi_vdma_3/S_AXI_LITE/Reg]
assign_bd_address -offset 0x43C00000 -range 64K -target_address_space [get_bd_addr_spaces hdmi_output/logicvc_1/videoData] [get_bd_addr_segs axi_perf_mon_1/S_AXI/Reg]
assign_bd_address -offset 0x43C10000 -range 64K -target_address_space [get_bd_addr_spaces hdmi_output/logicvc_1/videoData] [get_bd_addr_segs hdmi_output/logicvc_1/s_axi/reg0]
assign_bd_address -offset 0x43C20000 -range 64K -target_address_space [get_bd_addr_spaces hdmi_output/logicvc_1/videoData] [get_bd_addr_segs processing/image_filter_1/s_axi_CONTROL_BUS/Reg]
assign_bd_address -offset 0x43C30000 -range 64K -target_address_space [get_bd_addr_spaces hdmi_output/logicvc_1/videoData] [get_bd_addr_segs tpg_input/v_tc_1/ctrl/Reg]
assign_bd_address -offset 0x43C40000 -range 64K -target_address_space [get_bd_addr_spaces hdmi_output/logicvc_1/videoData] [get_bd_addr_segs tpg_input/v_tpg_1/s_axi_CTRL/Reg]
exclude_bd_addr_seg -offset 0x41600000 -range 64K -target_address_space [get_bd_addr_spaces processing/axi_vdma_2/Data_MM2S] [get_bd_addr_segs axi_iic_1/S_AXI/Reg]
exclude_bd_addr_seg -offset 0x43000000 -range 64K -target_address_space [get_bd_addr_spaces processing/axi_vdma_2/Data_MM2S] [get_bd_addr_segs fmc_hdmi_input/axi_vdma_1/S_AXI_LITE/Reg]
exclude_bd_addr_seg -offset 0x43010000 -range 64K -target_address_space [get_bd_addr_spaces processing/axi_vdma_2/Data_MM2S] [get_bd_addr_segs processing/axi_vdma_2/S_AXI_LITE/Reg]
exclude_bd_addr_seg -offset 0x43020000 -range 64K -target_address_space [get_bd_addr_spaces processing/axi_vdma_2/Data_MM2S] [get_bd_addr_segs tpg_input/axi_vdma_3/S_AXI_LITE/Reg]
exclude_bd_addr_seg -offset 0x43C00000 -range 64K -target_address_space [get_bd_addr_spaces processing/axi_vdma_2/Data_MM2S] [get_bd_addr_segs axi_perf_mon_1/S_AXI/Reg]
exclude_bd_addr_seg -offset 0x43C10000 -range 64K -target_address_space [get_bd_addr_spaces processing/axi_vdma_2/Data_MM2S] [get_bd_addr_segs hdmi_output/logicvc_1/s_axi/reg0]
exclude_bd_addr_seg -offset 0x43C20000 -range 64K -target_address_space [get_bd_addr_spaces processing/axi_vdma_2/Data_MM2S] [get_bd_addr_segs processing/image_filter_1/s_axi_CONTROL_BUS/Reg]
exclude_bd_addr_seg -offset 0x43C30000 -range 64K -target_address_space [get_bd_addr_spaces processing/axi_vdma_2/Data_MM2S] [get_bd_addr_segs tpg_input/v_tc_1/ctrl/Reg]
exclude_bd_addr_seg -offset 0x43C40000 -range 64K -target_address_space [get_bd_addr_spaces processing/axi_vdma_2/Data_MM2S] [get_bd_addr_segs tpg_input/v_tpg_1/s_axi_CTRL/Reg]
exclude_bd_addr_seg -offset 0x41600000 -range 64K -target_address_space [get_bd_addr_spaces processing/axi_vdma_2/Data_S2MM] [get_bd_addr_segs axi_iic_1/S_AXI/Reg]
exclude_bd_addr_seg -offset 0x43000000 -range 64K -target_address_space [get_bd_addr_spaces processing/axi_vdma_2/Data_S2MM] [get_bd_addr_segs fmc_hdmi_input/axi_vdma_1/S_AXI_LITE/Reg]
exclude_bd_addr_seg -offset 0x43010000 -range 64K -target_address_space [get_bd_addr_spaces processing/axi_vdma_2/Data_S2MM] [get_bd_addr_segs processing/axi_vdma_2/S_AXI_LITE/Reg]
exclude_bd_addr_seg -offset 0x43020000 -range 64K -target_address_space [get_bd_addr_spaces processing/axi_vdma_2/Data_S2MM] [get_bd_addr_segs tpg_input/axi_vdma_3/S_AXI_LITE/Reg]
exclude_bd_addr_seg -offset 0x43C00000 -range 64K -target_address_space [get_bd_addr_spaces processing/axi_vdma_2/Data_S2MM] [get_bd_addr_segs axi_perf_mon_1/S_AXI/Reg]
exclude_bd_addr_seg -offset 0x43C10000 -range 64K -target_address_space [get_bd_addr_spaces processing/axi_vdma_2/Data_S2MM] [get_bd_addr_segs hdmi_output/logicvc_1/s_axi/reg0]
exclude_bd_addr_seg -offset 0x43C20000 -range 64K -target_address_space [get_bd_addr_spaces processing/axi_vdma_2/Data_S2MM] [get_bd_addr_segs processing/image_filter_1/s_axi_CONTROL_BUS/Reg]
exclude_bd_addr_seg -offset 0x43C30000 -range 64K -target_address_space [get_bd_addr_spaces processing/axi_vdma_2/Data_S2MM] [get_bd_addr_segs tpg_input/v_tc_1/ctrl/Reg]
exclude_bd_addr_seg -offset 0x43C40000 -range 64K -target_address_space [get_bd_addr_spaces processing/axi_vdma_2/Data_S2MM] [get_bd_addr_segs tpg_input/v_tpg_1/s_axi_CTRL/Reg]
assign_bd_address -offset 0x41600000 -range 64K -target_address_space [get_bd_addr_spaces processing_system7_1/Data] [get_bd_addr_segs axi_iic_1/S_AXI/Reg]
assign_bd_address -offset 0x43000000 -range 64K -target_address_space [get_bd_addr_spaces processing_system7_1/Data] [get_bd_addr_segs fmc_hdmi_input/axi_vdma_1/S_AXI_LITE/Reg]
assign_bd_address -offset 0x43010000 -range 64K -target_address_space [get_bd_addr_spaces processing_system7_1/Data] [get_bd_addr_segs processing/axi_vdma_2/S_AXI_LITE/Reg]
assign_bd_address -offset 0x43020000 -range 64K -target_address_space [get_bd_addr_spaces processing_system7_1/Data] [get_bd_addr_segs tpg_input/axi_vdma_3/S_AXI_LITE/Reg]
assign_bd_address -offset 0x43C00000 -range 64K -target_address_space [get_bd_addr_spaces processing_system7_1/Data] [get_bd_addr_segs axi_perf_mon_1/S_AXI/Reg]
assign_bd_address -offset 0x43C10000 -range 64K -target_address_space [get_bd_addr_spaces processing_system7_1/Data] [get_bd_addr_segs hdmi_output/logicvc_1/s_axi/reg0]
assign_bd_address -offset 0x43C20000 -range 64K -target_address_space [get_bd_addr_spaces processing_system7_1/Data] [get_bd_addr_segs processing/image_filter_1/s_axi_CONTROL_BUS/Reg]
assign_bd_address -offset 0x43C30000 -range 64K -target_address_space [get_bd_addr_spaces processing_system7_1/Data] [get_bd_addr_segs tpg_input/v_tc_1/ctrl/Reg]
assign_bd_address -offset 0x43C40000 -range 64K -target_address_space [get_bd_addr_spaces processing_system7_1/Data] [get_bd_addr_segs tpg_input/v_tpg_1/s_axi_CTRL/Reg]

validate_bd_design
save_bd_design
